# EAGLE design Tek_AVR3 revA (EAGLE 5.11)
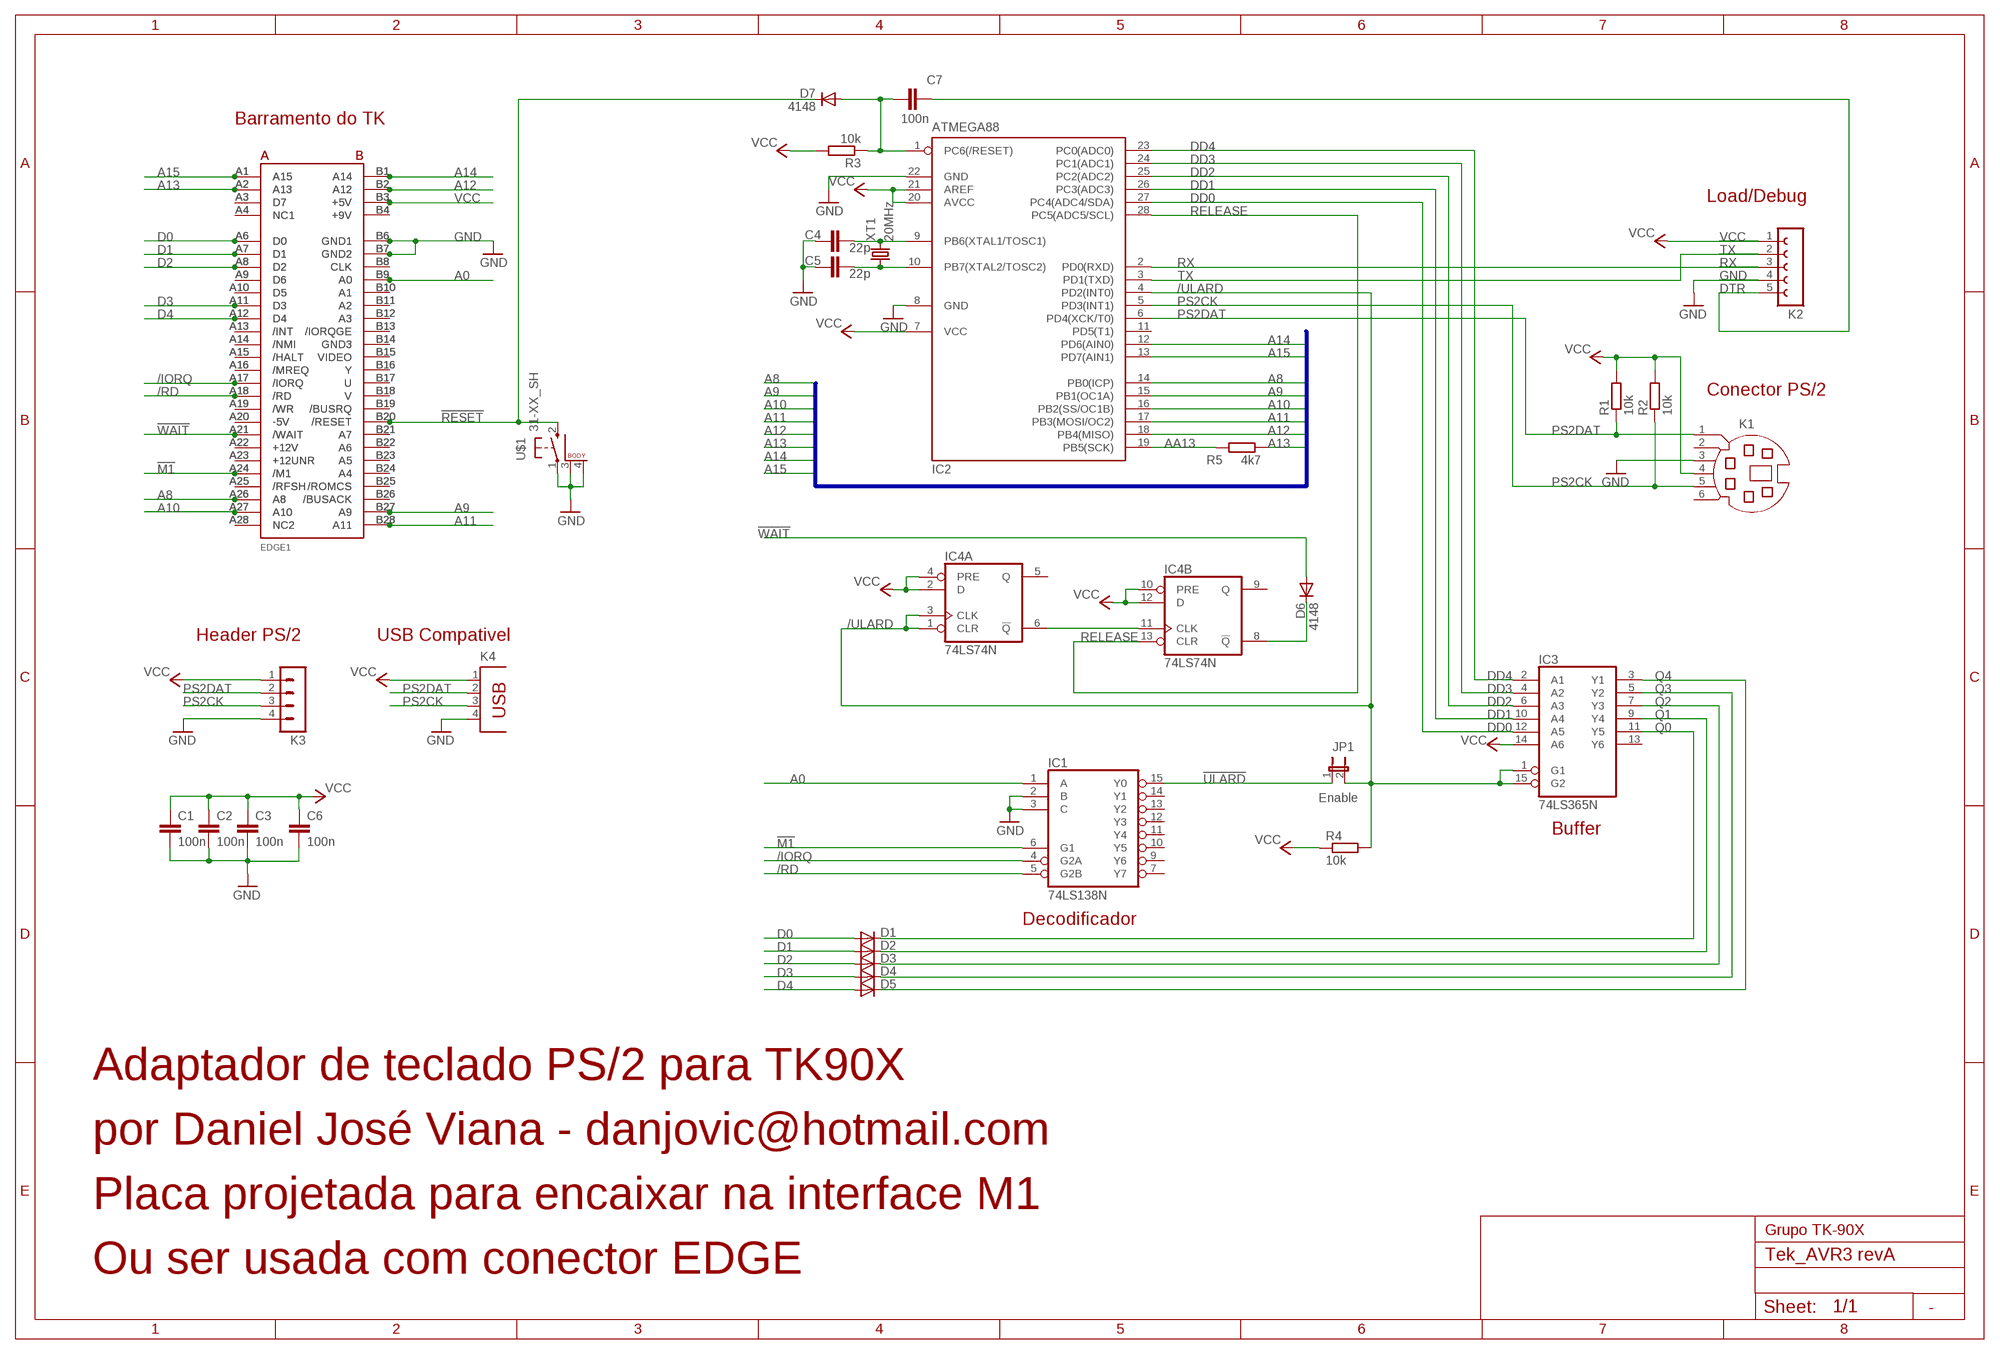
[diagram p0: schematic, sheet 1]

## Parts
C1  100n  C-EU075-032X103  [C075-032X103]
C2  100n  C-EU025-030X050  [C025-030X050]
C3  100n  C-EU050-030X075  [C050-030X075]
C4  22p  C-EU025-024X044  [C025-024X044]
C5  22p  C-EU025-025X050  [C025-025X050]
C6  100n  C-EU050-030X075  [C050-030X075]
C7  100n  C-EU050-030X075  [C050-030X075]
D1  DIODE-D-5  [D-5]
D2  DIODE-D-5  [D-5]
D3  DIODE-D-5  [D-5]
D4  DIODE-D-5  [D-5]
D5  DIODE-D-5  [D-5]
D6  4148  DIODE-D-5  [D-5]
D7  4148  DIODE-D-5  [D-5]
EDGE1  ZX-EDGEM1-NOBOARD  [ZX-M1-NOBOARD]
EDGE2  ZX-EDGE  [ZX-DIL]
IC1  74LS138N  [DIL16]
IC2  ATMEGA88  MEGA8-P  [DIL28-3]
IC3  74LS365N  [DIL16]
IC4  74LS74N  [DIL14]
JP1  Enable  JP1E  [JP1]
K1  MD06SS  [MDIN06SS]
K2  FE05-1  [FE05-1]
K3  MA04-1  [MA04-1]
K4  PN87520  [PN87520]
R1  10k  R-EU_0204/7  [0204/7]
R2  10k  R-EU_0204/7  [0204/7]
R3  10k  R-EU_0204/7  [0204/7]
R4  10k  R-EU_0204/7  [0204/7]
R5  4k7  R-EU_0204/7  [0204/7]
U$1  31-XX_SH  [B3F-31XX]
XT1  20MHz  CRYSTALHC49S  [HC49/S]

## Nets
!M1: EDGE1.A24(/M1) EDGE2.A24(/M1) IC1.6(G1)
!RESET: D7.C EDGE1.B20(/RESET) EDGE2.B20(/RESET) U$1.2(S)
!ULARD: IC1.15(Y0) JP1.1
!WAIT: D6.A EDGE1.A21(/WAIT) EDGE2.A21(/WAIT)
/IORQ: EDGE1.A17(/IORQ) EDGE2.A17(/IORQ) IC1.4(G2A)
/RD: EDGE1.A18(/RD) EDGE2.A18(/RD) IC1.5(G2B)
/ULARD: IC2.4(PD2(INT0)) IC3.1(G1) IC3.15(G2) IC4.1(A:CLR) IC4.3(A:CLK) JP1.2 R4.2
/WWAIT: D6.C IC4.8(B:!Q)
A0: EDGE1.B9(A0) EDGE2.B9(A0) IC1.1(A)
A8: EDGE1.A26(A8) EDGE2.A26(A8) IC2.14(PB0(ICP))
A9: EDGE1.B27(A9) EDGE2.B27(A9) IC2.15(PB1(OC1A))
A10: EDGE1.A27(A10) EDGE2.A27(A10) IC2.16(PB2(SS/OC1B))
A11: EDGE1.B28(A11) EDGE2.B28(A11) IC2.17(PB3(MOSI/OC2))
A12: EDGE1.B2(A12) EDGE2.B2(A12) IC2.18(PB4(MISO))
A13: EDGE1.A2(A13) EDGE2.A2(A13) R5.1
A14: EDGE1.B1(A14) EDGE2.B1(A14) IC2.12(PD6(AIN0))
A15: EDGE1.A1(A15) EDGE2.A1(A15) IC2.13(PD7(AIN1))
AA13: IC2.19(PB5(SCK)) R5.2
D0: D1.A EDGE1.A6(D0) EDGE2.A6(D0)
D1: D2.A EDGE1.A7(D1) EDGE2.A7(D1)
D2: D3.A EDGE1.A8(D2) EDGE2.A8(D2)
D3: D4.A EDGE1.A11(D3) EDGE2.A11(D3)
D4: D5.A EDGE1.A12(D4) EDGE2.A12(D4)
DD0: IC2.27(PC4(ADC4/SDA)) IC3.12(A5)
DD1: IC2.26(PC3(ADC3)) IC3.10(A4)
DD2: IC2.25(PC2(ADC2)) IC3.6(A3)
DD3: IC2.24(PC1(ADC1)) IC3.4(A2)
DD4: IC2.23(PC0(ADC0)) IC3.2(A1)
DTR: C7.2 K2.5
GND: C1.2 C2.2 C3.2 C4.1 C5.1 C6.2 EDGE1.B6(GND1) EDGE1.B7(GND2) EDGE2.B6(GND1) EDGE2.B7(GND2) IC1.2(B) IC1.3(C) IC2.8(GND) IC2.22(GND) K1.3 K2.4 K3.4 K4.4 U$1.1(P) U$1.3(P1) U$1.4(S1)
N$57: EDGE1.A3(D7) EDGE2.A3(D7)
N$59: EDGE1.A4(NC1) EDGE2.A4(NC1)
N$60: EDGE1.A9(D6) EDGE2.A9(D6)
N$61: EDGE1.A10(D5) EDGE2.A10(D5)
N$62: EDGE1.A13(/INT) EDGE2.A13(/INT)
N$63: EDGE1.A14(/NMI) EDGE2.A14(/NMI)
N$64: EDGE1.A15(/HALT) EDGE2.A15(/HALT)
N$65: EDGE1.A16(/MREQ) EDGE2.A16(/MREQ)
N$66: EDGE1.A19(/WR) EDGE2.A19(/WR)
N$67: EDGE1.A20(-5V) EDGE2.A20(-5V)
N$69: EDGE1.A22(+12V) EDGE2.A22(+12V)
N$70: EDGE1.A23(+12UNR) EDGE2.A23(+12UNR)
N$72: EDGE1.A25(/RFSH) EDGE2.A25(/RFSH)
N$73: EDGE1.A28(NC2) EDGE2.A28(NC2)
N$74: EDGE1.B14(GND3) EDGE2.B14(GND3)
N$75: EDGE1.B26(/BUSACK) EDGE2.B26(/BUSACK)
N$76: EDGE1.B25(/ROMCS) EDGE2.B25(/ROMCS)
N$77: EDGE1.B24(A4) EDGE2.B24(A4)
N$78: EDGE1.B23(A5) EDGE2.B23(A5)
N$79: EDGE1.B22(A6) EDGE2.B22(A6)
N$80: EDGE1.B21(A7) EDGE2.B21(A7)
N$82: EDGE1.B19(/BUSRQ) EDGE2.B19(/BUSRQ)
N$83: EDGE1.B18(V) EDGE2.B18(V)
N$84: EDGE1.B17(U) EDGE2.B17(U)
N$85: EDGE1.B16(Y) EDGE2.B16(Y)
N$86: EDGE1.B15(VIDEO) EDGE2.B15(VIDEO)
N$87: EDGE1.B13(/IORQGE) EDGE2.B13(/IORQGE)
N$88: EDGE1.B12(A3) EDGE2.B12(A3)
N$89: EDGE1.B11(A2) EDGE2.B11(A2)
N$90: EDGE1.B10(A1) EDGE2.B10(A1)
N$91: EDGE1.B8(CLK) EDGE2.B8(CLK)
N$92: EDGE1.B4(+9V) EDGE2.B4(+9V)
PB6: C4.2 IC2.9(PB6(XTAL1/TOSC1)) XT1.2
PB7: C5.2 IC2.10(PB7(XTAL2/TOSC2)) XT1.1
PC6/RESET: C7.1 D7.A IC2.1(PC6(/RESET)) R3.1
PS2CK: IC2.5(PD3(INT1)) K1.5 K3.3 K4.3 R2.1
PS2DAT: IC2.6(PD4(XCK/T0)) K1.1 K3.2 K4.2 R1.1
Q0: D1.C IC3.11(Y5)
Q1: D2.C IC3.9(Y4)
Q2: D3.C IC3.7(Y3)
Q3: D4.C IC3.5(Y2)
Q4: D5.C IC3.3(Y1)
RELEASE: IC2.28(PC5(ADC5/SCL)) IC4.13(B:CLR)
RX: IC2.2(PD0(RXD)) K2.3
TX: IC2.3(PD1(TXD)) K2.2
ULARD: IC4.6(A:!Q) IC4.11(B:CLK)
VCC: C1.1 C2.1 C3.1 C6.1 EDGE1.B3(+5V) EDGE2.B3(+5V) IC2.7(VCC) IC2.20(AVCC) IC2.21(AREF) IC3.14(A6) IC4.2(A:D) IC4.4(A:PRE) IC4.10(B:PRE) IC4.12(B:D) K1.4 K2.1 K3.1 K4.1 R1.2 R2.2 R3.2 R4.1
Unconnected: IC1.7(Y7) IC1.9(Y6) IC1.10(Y5) IC1.11(Y4) IC1.12(Y3) IC1.13(Y2) IC1.14(Y1) IC2.11(PD5(T1)) IC3.13(Y6) IC4.5(A:Q) IC4.9(B:Q) K1.2 K1.6

## Buses
A[8..15]

## Notes on the sheet
- Barramento do TK
- Load/Debug
- Conector PS/2
- Header PS/2 | USB Compativel
- Buffer
- Decodificador
- Adaptador de teclado PS/2 para TK90X
- por Daniel José Viana - danjovic@hotmail.com
- Placa projetada para encaixar na interface M1
- Grupo TK-90X
- Ou ser usada com conector EDGE
- -

## Power pins joined to a net without a drawn wire
GND: IC1.8(GND) IC3.8(GND) IC4.7(P:GND)
VCC: IC1.16(VCC) IC3.16(VCC) IC4.14(P:VCC)

## Library data of the parts
C1-C7 = rcl:C-EU: CAPACITOR, European symbol
D1-D7 = diode:DIODE-: DIODE
EDGE1 EDGE2 = diversos2:ZX-EDGE: ZX Spectrum Rear edge connector
IC1 = 74xx-us:74*138: 3-line to 8-line DECODER/DEMULTIPLEXER
IC2 = atmel:MEGA8-P: MICROCONTROLLER 8 Kbytes FLASH, 1 kbytes SRAM, 512 bytes EEPROM, USART, 4-channel 10 bit ADC, 2-channel 8 bit ADC Pin compatible with Atmega48, ATMega88, ATMega168 Source: avr.lbr; OC_FARNELL: unknown; OC_NEWARK: unknown
IC3 = 74xx-us:74*365: Hex BUS DRIVER, 3-state
IC4 = 74xx-us:74*74: Dual D type positive edge triggered FLIP FLOP, preset and clear
JP1 = jumper:JP1E: JUMPER
K1 = con-yamaichi:MD06SS: YAMAICHI CONNECTOR; OC_FARNELL: unknown; OC_NEWARK: unknown
K2 = con-lsta:FE05-1: FEMALE HEADER; OC_FARNELL: unknown; OC_NEWARK: unknown
K3 = con-lstb:MA04-1: PIN HEADER; OC_FARNELL: unknown; OC_NEWARK: unknown
K4 = con-berg:PN87520: BERG USB connector; OC_FARNELL: unknown; OC_NEWARK: unknown
R1-R5 = rcl:R-EU_: RESISTOR, European symbol
U$1 = switch-omron:31-XX_SH
XT1 = crystal:CRYSTAL: CRYSTAL; OC_FARNELL: 1667008; OC_NEWARK: unknown

## Board
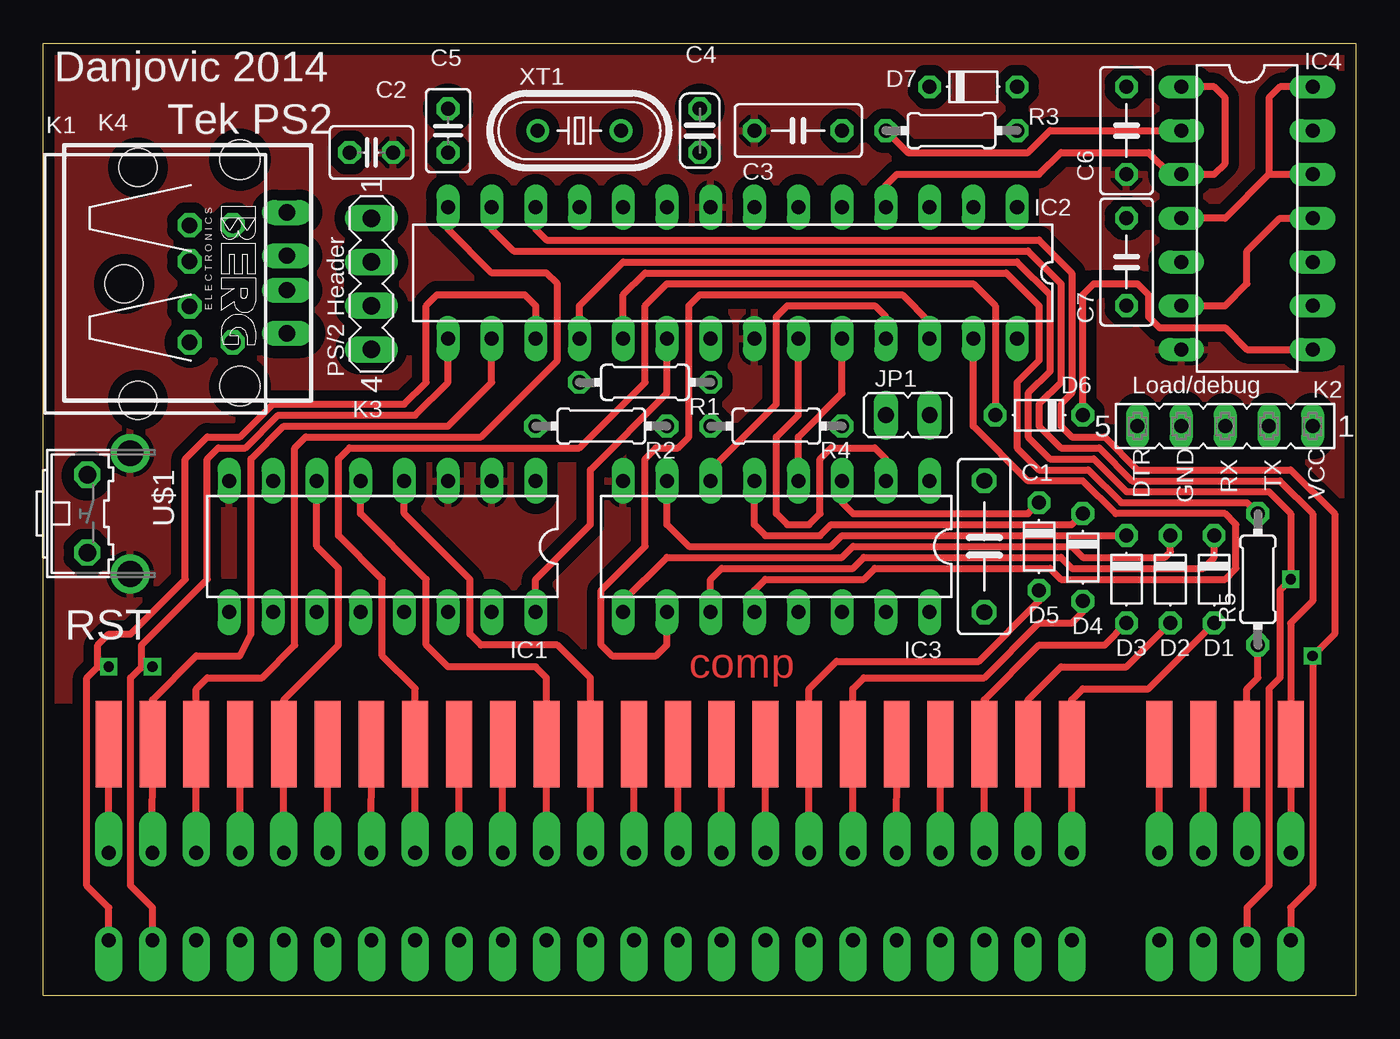
[diagram p1: board, top side]
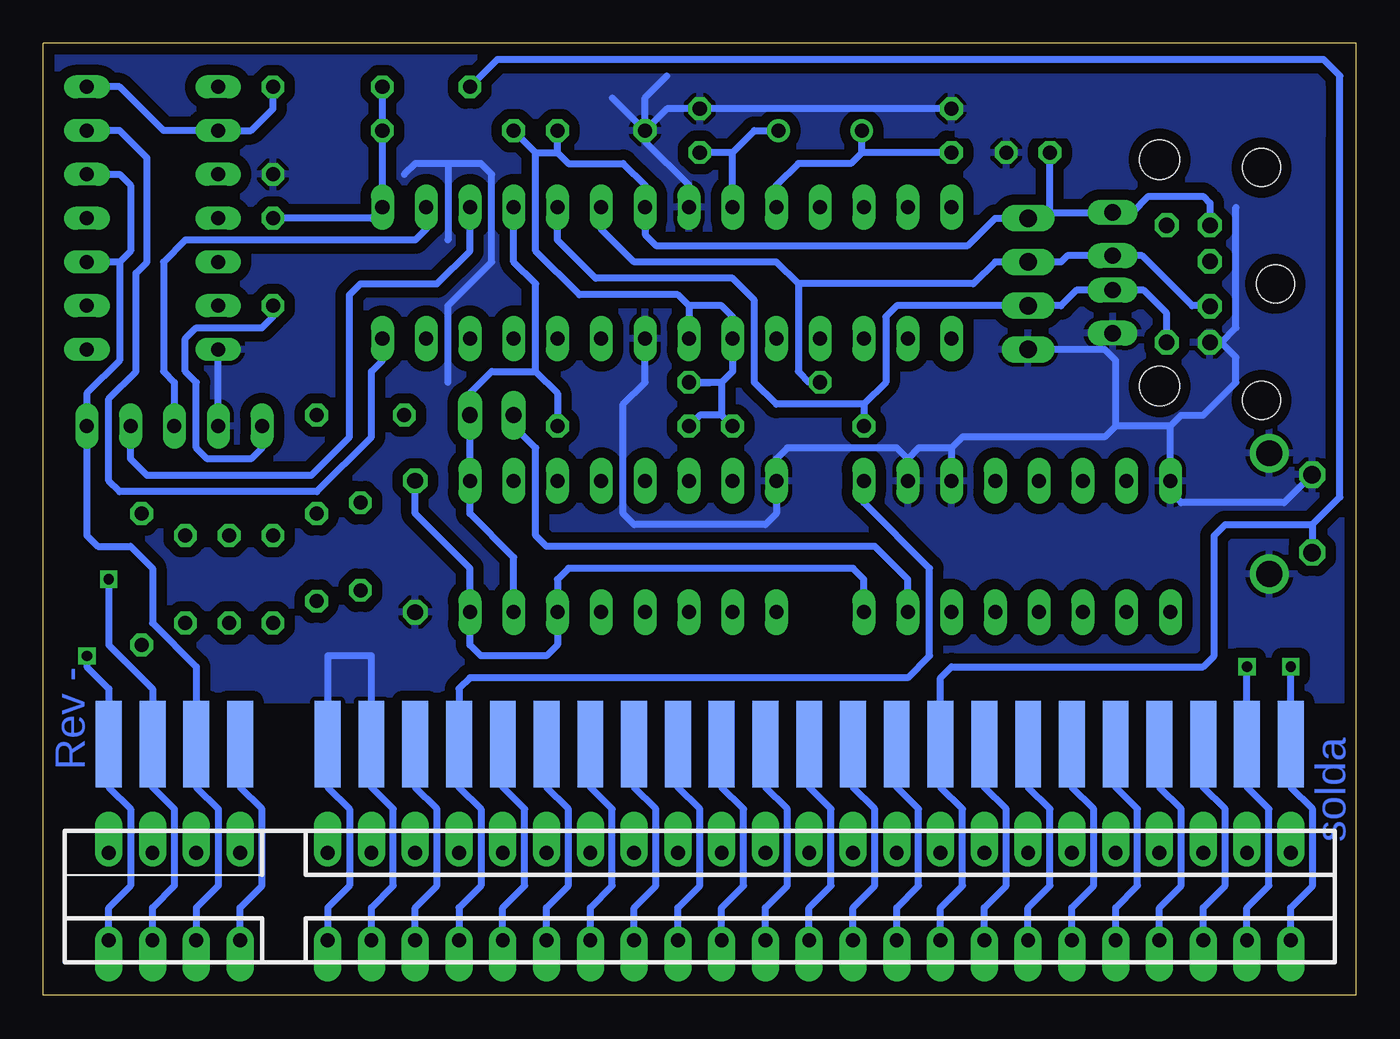
[diagram p2: board, bottom side, seen from below]

Size 76.2 x 55.25 mm. Coordinates in mm from the lower left corner, seen from the top.
Outline: 0,0 76.2,0 76.2,55.25 0,55.25 0,0
Copper layers (1*16): Top 0.035mm / dielectric 1.5mm / Bottom 0.035mm
Design rules "default *": minimum track width 10mil, minimum drill 24mil, track to track 8mil, track to pad 8mil, pad to pad 8mil, via to via 8mil, smd to smd 8mil, copper to edge 25mil, drill to drill 8mil, minimum pad ring 10mil, minimum via ring 8mil, stop-mask expansion 4mil, vias tented up to drill 0mil, thermal gap 10mil
tRestrict: area 22.9,50.8 to 24.1,52.1; area 37.5,50.8 to 38.7,52.1; area 7.9,37.2 to 9.1,38.5; area 1.9,29.5 to 3.2,30.8; area 54,21.6 to 55.2,22.9; 9 lines

### Footprints (pad centres in the part's own frame; a part is rotated, then mirrored left to right if it is on the bottom)
C075-032X103 = drill 0.914 octagon: 1 -3.81,0; 2 3.81,0
C025-030X050 = drill 0.813 octagon: 1 -1.27,0; 2 1.27,0
C050-030X075 = drill 0.813 octagon: 1 -2.54,0; 2 2.54,0
C025-024X044 = drill 0.813 octagon: 1 -1.27,0; 2 1.27,0
C025-025X050 = drill 0.813 octagon: 1 -1.27,0; 2 1.27,0
D-5 = drill 0.813 octagon: A 2.54,0; C -2.54,0
ZX-M1-NOBOARD = smd 1.5 x 5: A1 68.575,2.5; A2 66.035,2.5; A3 63.495,2.5; A4 60.955,2.5; A6 55.875,2.5; A7 53.335,2.5; A8 50.795,2.5; A9 48.255,2.5; A10 45.715,2.5; A11 43.175,2.5; A12 40.635,2.5; A13 38.095,2.5; A14 35.555,2.5; A15 33.015,2.5; A16 30.475,2.5; A17 27.935,2.5; A18 25.395,2.5; A19 22.855,2.5; A20 20.315,2.5; A21 17.775,2.5; A22 15.235,2.5; A23 12.695,2.5; A24 10.155,2.5; A25 7.615,2.5; A26 5.075,2.5; A27 2.535,2.5; A28 -0.005,2.5 | smd 1.5 x 5 bottom: B1 68.575,2.5; B2 66.035,2.5; B3 63.495,2.5; B4 60.955,2.5; B6 55.875,2.5; B7 53.335,2.5; B8 50.795,2.5; B9 48.255,2.5; B10 45.715,2.5; B11 43.175,2.5; B12 40.635,2.5; B13 38.095,2.5; B14 35.555,2.5; B15 33.015,2.5; B16 30.475,2.5; B17 27.935,2.5; B18 25.395,2.5; B19 22.855,2.5; B20 20.315,2.5; B21 17.775,2.5; B22 15.235,2.5; B23 12.695,2.5; B24 10.155,2.5; B25 7.615,2.5; B26 5.075,2.5; B27 2.535,2.5; B28 -0.005,2.5
ZX-DIL = drill 0.8 pad 1.6 offset: A1 2.54,33.02; A2 2.54,30.48; A3 2.54,27.94; A4 2.54,25.4; A6 2.54,20.32; A7 2.54,17.78; A8 2.54,15.24; A9 2.54,12.7; A10 2.54,10.16; A11 2.54,7.62; A12 2.54,5.08; A13 2.54,2.54; A14 2.54,0; A15 2.54,-2.54; A16 2.54,-5.08; A17 2.54,-7.62; A18 2.54,-10.16; A19 2.54,-12.7; A20 2.54,-15.24; A21 2.54,-17.78; A22 2.54,-20.32; A23 2.54,-22.86; A24 2.54,-25.4; A25 2.54,-27.94; A26 2.54,-30.48; A27 2.54,-33.02; A28 2.54,-35.56; B1 -2.54,33.02; B2 -2.54,30.48; B3 -2.54,27.94; B4 -2.54,25.4; B6 -2.54,20.32; B7 -2.54,17.78; B8 -2.54,15.24; B9 -2.54,12.7; B10 -2.54,10.16; B11 -2.54,7.62; B12 -2.54,5.08; B13 -2.54,2.54; B14 -2.54,0; B15 -2.54,-2.54; B16 -2.54,-5.08; B17 -2.54,-7.62; B18 -2.54,-10.16; B19 -2.54,-12.7; B20 -2.54,-15.24; B21 -2.54,-17.78; B22 -2.54,-20.32; B23 -2.54,-22.86; B24 -2.54,-25.4; B25 -2.54,-27.94; B26 -2.54,-30.48; B27 -2.54,-33.02; B28 -2.54,-35.56
DIL16 = drill 0.813 long: 1 -8.89,-3.81; 2 -6.35,-3.81; 3 -3.81,-3.81; 4 -1.27,-3.81; 5 1.27,-3.81; 6 3.81,-3.81; 7 6.35,-3.81; 8 8.89,-3.81; 9 8.89,3.81; 10 6.35,3.81; 11 3.81,3.81; 12 1.27,3.81; 13 -1.27,3.81; 14 -3.81,3.81; 15 -6.35,3.81; 16 -8.89,3.81
DIL28-3 = drill 0.813 long: 1 -16.51,-3.81; 2 -13.97,-3.81; 3 -11.43,-3.81; 4 -8.89,-3.81; 5 -6.35,-3.81; 6 -3.81,-3.81; 7 -1.27,-3.81; 8 1.27,-3.81; 9 3.81,-3.81; 10 6.35,-3.81; 11 8.89,-3.81; 12 11.43,-3.81; 13 13.97,-3.81; 14 16.51,-3.81; 15 16.51,3.81; 16 13.97,3.81; 17 11.43,3.81; 18 8.89,3.81; 19 6.35,3.81; 20 3.81,3.81; 21 1.27,3.81; 22 -1.27,3.81; 23 -3.81,3.81; 24 -6.35,3.81; 25 -8.89,3.81; 26 -11.43,3.81; 27 -13.97,3.81; 28 -16.51,3.81
DIL14 = drill 0.813 long: 1 -7.62,-3.81; 2 -5.08,-3.81; 3 -2.54,-3.81; 4 0,-3.81; 5 2.54,-3.81; 6 5.08,-3.81; 7 7.62,-3.81; 8 7.62,3.81; 9 5.08,3.81; 10 2.54,3.81; 11 0,3.81; 12 -2.54,3.81; 13 -5.08,3.81; 14 -7.62,3.81
JP1 = drill 0.914 long: 1 0,-1.27; 2 0,1.27
MDIN06SS = drill 0.9 octagon: 1 1.3,8.5; 2 -1.3,8.5; 3 3.4,8.5; 4 -3.4,8.5; 5 3.4,11; 6 -3.4,11 | hole 2.2: -6.75,5.5; 0,4.7; 6.75,5.5
FE05-1 = drill 0.813 long: 1 -5.08,0; 2 -2.54,0; 3 0,0; 4 2.54,0; 5 5.08,0
MA04-1 = drill 1.016 long: 1 -3.81,0; 2 -1.27,0; 3 1.27,0; 4 3.81,0
PN87520 = drill 0.95 long: 1 -3.5,2.71; 2 -1,2.71; 3 1,2.71; 4 3.5,2.71 | hole 2.3: -6.57,0; 6.57,0
0204/7 = drill 0.813 octagon: 1 -3.81,0; 2 3.81,0
B3F-31XX = drill 1.016 octagon: 1 -2.261,-1.245; 2 2.261,-1.245 | drill 1.499 pad 2.159 round: 3 -3.505,1.245; 4 3.505,1.245
HC49/S = drill 0.813 round: 1 -2.413,0; 2 2.413,0

### Placement (x,y rotation side)
C1  54.61,26.04 270 top
C2  19.05,48.9 0 top
C3  43.81,50.16 180 top
C4  38.1,50.16 270 top
C5  23.5,50.16 270 top
C6  62.87,50.16 270 top
C7  62.87,42.55 270 top
D1  67.94,24.13 270 top
D2  65.41,24.13 270 top
D3  62.87,24.13 270 top
D4  60.33,25.4 270 top
D5  57.78,26.04 270 top
D6  57.78,33.66 180 top
D7  53.98,52.7 0 top
EDGE1  3.81,12.06 0 top
EDGE2  39.37,5.71 90 bottom
IC1  19.68,26.04 180 top
IC2  40.01,41.91 180 top
IC3  42.55,26.04 180 top
IC4  69.85,45.09 270 top
JP1  50.16,33.66 270 top
K1  0,41.27 270 top
K2  68.58,33.02 180 top
K3  19.05,41.27 270 top
K4  11.43,41.91 270 top
R1  34.92,35.56 0 top
R2  32.38,33.02 0 top
R3  52.7,50.16 180 top
R4  42.55,33.02 0 top
R5  70.48,24.13 90 top
U$1  3.81,27.94 270 top
XT1  31.11,50.16 0 top

### Tracks (layer width: path | path; a pad name or v marks a point on that pad's centre or on a via)
!M1
  Top 0.406: EDGE2.A24 EDGE1.A24 13.97,17.14 17.14,20.32 17.14,24.77 15.88,26.04 IC1.6
!RESET
  Bottom 0.406: EDGE2.B20 24.13,5.08 22.86,6.35 22.86,10.79 24.12,12.06 EDGE1.B20 24.13,18.42 23.5,19.05 8.89,19.05 8.26,19.69 8.26,26.67 7.62,27.3 2.56,27.3 | D7.C 49.85,54.29 1.91,54.29 0.95,53.34 0.95,28.89 0.98,28.89 2.56,27.3 | 2.56,27.3 U$1.2
!ULARD
  Bottom 0.406: IC1.15 26.04,24.13 27.94,26.04 46.99,26.04 47.62,26.67 47.62,31.75 48.9,33.02 JP1.1
!WAIT
  Top 0.406: EDGE2.A21 EDGE1.A21 21.59,17.79 19.68,19.69 19.68,24.13 17.14,26.67 17.14,31.12 17.78,31.75 31.11,31.75 34.92,35.56 34.92,40.01 36.2,41.27 53.98,41.27 55.24,40.01 D6.A
/IORQ
  Top 0.406: EDGE2.A17 EDGE1.A17 31.75,18.42 29.84,20.32 25.4,20.32 24.77,20.96 24.77,24.13 20.95,27.94 IC1.4
/RD
  Top 0.406: EDGE2.A18 EDGE1.A18 29.21,18.42 28.57,19.05 23.5,19.05 22.23,20.32 22.23,24.13 18.41,27.94 IC1.5
/ULARD
  Top 0.406: IC2.4 48.9,46.99 49.53,47.62 57.78,47.62 59.05,48.9 64.14,48.9 65.41,47.62 IC4.3 67.94,47.62 68.58,48.26 68.58,52.07 67.94,52.7 IC4.1
  Bottom 0.406: IC2.4 48.9,42.55 47.62,41.27 47.62,36.2 | R4.2 46.35,34.93 47.62,36.2 | 47.62,36.2 50.16,36.2 51.44,34.93 JP1.2 IC3.1 51.44,27.94 48.9,25.4 IC3.15
/WWAIT
  Top 0.406: IC4.8 69.85,37.47 68.58,38.73 64.77,38.73 64.14,39.37 64.14,40.64 63.5,41.27 60.96,41.27 60.33,40.64 D6.C
A0
  Bottom 0.406: EDGE2.B9 52.07,5.08 50.8,6.35 50.8,10.79 52.06,12.06 EDGE1.B9 52.06,17.79 51.44,18.42 26.04,18.42 24.77,19.69 24.77,24.77 28.57,28.58 IC1.1
A8
  Top 0.406: EDGE2.A26 EDGE1.A26 8.89,17.78 9.53,18.42 12.7,18.42 14.61,20.32 14.61,31.75 15.24,32.38 25.4,32.38 29.84,36.83 29.84,41.27 29.21,41.91 26.04,41.91 23.5,44.45 IC2.14
A9  (via drill 0.6)
  Top 0.406: IC2.15 23.5,35.56 21.59,33.66 13.65,33.66 11.75,31.75 10.16,31.75 9.53,31.12 9.53,24.13 5.71,20.32 5.71,19.05 | 5.71,19.05 v6.35,19.05 | 5.71,19.05 5.08,18.42 5.08,6.35 6.35,5.08 EDGE2.B27
  Bottom 0.406: EDGE2.B27 6.35,5.08 5.08,6.35 5.08,10.79 6.34,12.06 EDGE1.B27 v6.35,19.05
A10
  Top 0.406: EDGE2.A27 EDGE1.A27 6.35,17.14 8.89,19.69 11.43,19.69 12.06,20.96 12.06,31.12 13.97,33.02 23.5,33.02 26.04,35.56 IC2.16
A11  (via drill 0.6)
  Top 0.406: IC2.17 28.57,40.01 27.94,40.64 22.86,40.64 22.23,40.01 22.23,35.56 20.95,34.29 13.34,34.29 11.43,32.38 9.53,32.38 8.26,31.12 8.26,24.13 5.08,20.96 3.81,20.96 3.17,20.32 3.17,19.05 | 3.17,19.05 v3.81,19.05 | 3.17,19.05 2.54,18.42 2.54,6.35 3.81,5.08 EDGE2.B28
  Bottom 0.406: EDGE2.B28 3.81,5.08 2.54,6.35 2.54,10.79 3.81,12.06 EDGE1.B28 v3.81,19.05
A12  (via drill 0.6)
  Top 0.406: IC2.18 31.11,40.01 33.66,42.55 56.52,42.55 58.42,40.64 58.42,36.2 57.15,34.93 57.15,32.38 58.42,31.12 60.96,31.12 62.87,29.21 71.12,29.21 72.39,27.94 v72.39,24.13 71.75,23.5 71.75,18.42 71.12,17.78 71.12,6.35 69.85,5.08 EDGE2.B2
  Bottom 0.406: EDGE2.B2 69.85,5.08 68.58,6.35 68.58,10.79 69.84,12.06 EDGE1.B2 69.85,17.78 72.39,20.32 v72.39,24.13
A13
  Top 0.406: EDGE2.A2 EDGE1.A2 69.85,17.78 70.48,18.42 R5.1
A14  (via drill 0.6)
  Top 0.406: IC2.12 28.57,44.45 29.21,43.81 57.78,43.81 59.69,41.91 59.69,34.93 59.05,34.29 59.05,33.02 59.69,32.38 61.59,32.38 63.5,30.48 72.39,30.48 74.93,27.94 74.93,20.96 v73.66,19.69 73.66,6.35 72.39,5.08 EDGE2.B1
  Bottom 0.406: EDGE2.B1 72.39,5.08 71.12,6.35 71.12,10.79 72.39,12.06 EDGE1.B1 72.39,17.78 73.66,19.05 v73.66,19.69
A15
  Top 0.406: EDGE1.A1 72.39,14.6 | EDGE1.A1 EDGE2.A1 | IC2.13 26.04,44.45 27.3,43.18 57.15,43.18 59.05,41.27 59.05,35.56 57.78,34.29 57.78,33.02 59.05,31.75 61.28,31.75 63.18,29.85 71.75,29.85 73.66,27.94 73.66,22.86 72.39,21.59 EDGE1.A1
AA13
  Top 0.406: IC2.19 33.66,40.64 34.92,41.91 55.88,41.91 57.78,40.01 57.78,36.83 56.52,35.56 56.52,31.75 57.78,30.48 60.64,30.48 62.55,28.58 69.85,28.58 R5.2
D0
  Top 0.406: EDGE1.A6 | EDGE2.A6 EDGE1.A6 | EDGE1.A6 59.69,17.14 60.33,17.78 64.14,17.78 D1.A
D1
  Top 0.406: EDGE2.A7 EDGE1.A7 57.15,17.14 59.05,19.05 62.87,19.05 D2.A
D2
  Top 0.406: EDGE1.A8 | EDGE2.A8 EDGE1.A8 | EDGE1.A8 54.6,17.14 57.78,20.32 61.59,20.32 D3.A
D3
  Top 0.406: EDGE2.A11 EDGE1.A11 46.98,17.77 47.62,18.42 54.61,18.42 57.78,21.59 59.69,21.59 60.33,22.23 D4.A
D4
  Top 0.406: EDGE1.A12 | EDGE1.A12 EDGE2.A12 | EDGE1.A12 44.45,17.77 46.04,19.37 54.29,19.37 57.78,22.86 D5.A
DD0
  Top 0.406: IC3.12 41.27,23.5 41.91,24.13 47.62,24.13 48.26,24.77 58.42,24.77 59.05,24.13 68.58,24.13 69.22,24.77 69.22,26.04 69.22,27.3 68.58,27.94 62.23,27.94 60.33,29.85 57.15,29.85 53.98,33.02 IC2.27
DD1
  Top 0.406: IC2.26 51.44,39.05 49.85,40.64 38.1,40.64 37.47,40.01 37.47,32.38 36.83,31.75 35.56,31.75 34.92,31.12 34.92,26.04 32.38,23.5 32.38,20.32 33.02,19.69 35.56,19.69 36.2,20.32 IC3.10
DD2
  Top 0.406: IC3.6 38.73,30.48 42.55,34.29 42.55,39.37 43.18,40.01 48.26,40.01 48.9,39.37 IC2.25
DD3
  Top 0.406: IC3.4 43.81,32.38 46.35,34.93 IC2.24
DD4
  Top 0.406: IC3.2 48.9,31.12 48.26,31.75 45.72,31.75 45.09,31.12 45.09,27.94 44.45,27.3 43.18,27.3 42.55,27.94 42.55,32.38 43.81,33.66 IC2.23
DTR
  Bottom 0.406: C7.2 62.87,39.37 63.5,38.73 67.31,38.73 67.94,38.1 67.94,36.2 67.31,35.56 67.31,31.75 66.67,31.12 64.14,31.12 63.5,31.75 K2.5
GND
  Bottom 0.406: EDGE1.B7 | EDGE1.B7 57.15,12.06 55.88,10.79 55.88,6.35 57.15,5.08 EDGE2.B7 | EDGE2.B6 59.69,5.08 58.42,6.35 58.42,10.79 59.69,12.06 59.69,13.97 EDGE1.B6 | C5.1 C4.1 40.01,51.44 C3.2 | C3.2 41.27,49.53 38.73,46.99 IC2.8 | 23.5,31.75 IC1.3 | 23.5,31.75 25.4,31.75 26.04,31.12 | 23.5,31.75 22.86,32.38 14.61,32.38 13.97,33.02 | 26.04,31.12 IC1.2 | 26.04,31.12 26.67,31.75 33.02,31.75 33.66,31.12 IC3.8 33.66,27.94 34.29,27.3 41.91,27.3 42.55,27.94 42.55,34.29 41.27,35.56 IC2.22 | EDGE1.B6 | C3.2 43.18,52.07 | 40.01,53.34 41.27,52.07 C3.2 | 52.7,35.56 52.7,40.01 50.16,42.55 50.16,47.62 50.8,48.26 52.7,48.26 | U$1.1 4.19,28.58 10.16,28.58 10.79,29.21 IC1.8 10.79,33.02 | 52.7,48.26 54.61,48.26 55.24,47.62 | K3.4 14.61,37.47 13.97,36.83 13.97,33.02 | 10.79,33.02 13.97,33.02 | 10.79,33.02 10.16,33.66 8.89,33.66 6.99,35.56 6.99,37.02 7.84,37.88 | 6.99,45.72 6.99,38.73 7.84,37.88 | 7.84,37.88 K1.3 | K2.4 IC4.7 | 52.7,48.26 52.7,43.81 | EDGE1.B7 57.15,19.69 59.69,19.69 EDGE1.B6
  pour Bottom (isolate 0.61): -0.64,55.25 -0.64,17.14 76.83,17.14 76.83,55.25
  pour Top (isolate 0.61): 0,55.88 0,17.14 76.83,17.14 76.83,55.88
N$50
  pour Bottom: 23.18,49.85 1.91,49.85 1.91,52.7 2.54,53.34 23.18,53.34
N$57
  Top 0.406: EDGE1.A3 EDGE2.A3
N$59
  Top 0.406: EDGE1.A4 EDGE2.A4
N$60
  Top 0.406: EDGE2.A9 EDGE1.A9
N$61
  Top 0.406: EDGE1.A10 EDGE2.A10
N$62
  Top 0.406: EDGE1.A13 EDGE2.A13
N$63
  Top 0.406: EDGE1.A14 EDGE2.A14
N$64
  Top 0.406: EDGE1.A15 EDGE2.A15
N$65
  Top 0.406: EDGE1.A16 EDGE2.A16
N$66
  Top 0.406: EDGE1.A19 EDGE2.A19
N$67
  Top 0.406: EDGE1.A20 EDGE2.A20
N$69
  Top 0.406: EDGE1.A22 EDGE2.A22
N$70
  Top 0.406: EDGE1.A23 EDGE2.A23
N$72
  Top 0.406: EDGE1.A25 EDGE2.A25
N$73
  Top 0.406: EDGE1.A28 EDGE2.A28
N$74
  Bottom 0.406: EDGE1.B14 39.37,12.06 38.1,10.79 38.1,6.35 39.37,5.08 EDGE2.B14
N$75
  Bottom 0.406: EDGE1.B26 8.88,12.06 7.62,10.79 7.62,6.35 8.89,5.08 EDGE2.B26
N$76
  Bottom 0.406: EDGE1.B25 11.43,12.06 10.16,10.79 10.16,6.35 11.43,5.08 EDGE2.B25
N$77
  Bottom 0.406: EDGE1.B24 13.96,12.06 12.7,10.79 12.7,6.35 13.97,5.08 EDGE2.B24
N$78
  Bottom 0.406: EDGE1.B23 16.5,12.06 15.24,10.79 15.24,6.35 16.51,5.08 EDGE2.B23
N$79
  Bottom 0.406: EDGE2.B22 19.05,5.08 17.78,6.35 17.78,10.79 19.05,12.06 EDGE1.B22
N$80
  Bottom 0.406: EDGE1.B21 21.59,12.06 20.32,10.79 20.32,6.35 21.59,5.08 EDGE2.B21
N$82
  Bottom 0.406: EDGE1.B19 26.66,12.06 25.4,10.79 25.4,6.35 26.67,5.08 EDGE2.B19
N$83
  Bottom 0.406: EDGE1.B18 29.2,12.06 27.94,10.79 27.94,6.35 29.21,5.08 EDGE2.B18
N$84
  Bottom 0.406: EDGE1.B17 31.75,12.06 30.48,10.79 30.48,6.35 31.75,5.08 EDGE2.B17
N$85
  Bottom 0.406: EDGE1.B16 34.28,12.06 33.02,10.79 33.02,6.35 34.29,5.08 EDGE2.B16
N$86
  Bottom 0.406: EDGE1.B15 36.83,12.06 35.56,10.79 35.56,6.35 36.83,5.08 EDGE2.B15
N$87
  Bottom 0.406: EDGE1.B13 41.91,12.06 40.64,10.79 40.64,6.35 41.91,5.08 EDGE2.B13
N$88
  Bottom 0.406: EDGE1.B12 44.45,12.06 43.18,10.79 43.18,6.35 44.45,5.08 EDGE2.B12
N$89
  Bottom 0.406: EDGE1.B11 46.98,12.06 45.72,10.79 45.72,6.35 46.99,5.08 EDGE2.B11
N$90
  Bottom 0.406: EDGE1.B10 49.52,12.06 48.26,10.79 48.26,6.35 49.53,5.08 EDGE2.B10
N$91
  Bottom 0.406: EDGE1.B8 54.6,12.06 53.34,10.79 53.34,6.35 54.61,5.08 EDGE2.B8
N$92
  Bottom 0.406: EDGE1.B4 64.77,12.06 63.5,10.79 63.5,6.35 64.77,5.08 EDGE2.B4
PB6
  Bottom 0.406: XT1.2 34.92,50.16 36.2,48.9 | 36.2,48.9 C4.2 | IC2.9 36.2,48.9
PB7
  Bottom 0.406: C5.2 28.7,48.9 | 28.7,48.9 XT1.1 | IC2.10 33.66,46.99 32.38,48.26 29.34,48.26 28.7,48.9
PC6/RESET
  Bottom 0.406: D7.A R3.1 IC2.1 57.15,45.09 C7.1
PS2CK
  Bottom 0.406: IC2.5 46.35,43.81 44.13,41.59 36.2,41.59 34.92,40.32 34.92,35.56 33.66,34.29 28.57,34.29 | 28.57,34.29 R2.1 | 28.57,34.29 27.3,35.56 27.3,39.37 26.67,40.01 K3.3 17.14,40.01 16.24,40.91 K4.3 12.34,40.91 11,39.58 K1.5
PS2DAT
  Bottom 0.406: IC2.6 43.81,44.45 41.91,42.55 33.66,42.55 32.38,41.27 | 32.38,41.27 32.38,36.2 31.75,35.56 R1.1 | 32.38,41.27 22.23,41.27 20.95,42.55 K3.2 17.14,42.55 16.78,42.91 K4.2 12.43,42.91 9.53,40.01 8.53,40.01 K1.1
Q0
  Top 0.406: IC3.11 38.73,24.13 39.37,24.77 46.99,24.77 47.62,25.4 59.05,25.4 59.69,24.77 67.31,24.77 67.94,25.4 67.94,26.04 D1.C
Q1
  Top 0.406: IC3.9 33.66,22.86 36.2,25.4 46.35,25.4 46.99,26.04 59.69,26.04 60.33,25.4 65.09,25.4 65.41,25.72 D2.C
Q2
  Top 0.406: IC3.7 36.2,27.3 37.47,26.04 45.72,26.04 46.35,26.67 D3.C
Q3
  Top 0.406: D4.C 59.69,27.3 45.72,27.3 45.09,26.67 41.91,26.67 41.27,27.3 IC3.5
Q4
  Top 0.406: D5.C 57.15,27.94 46.99,27.94 46.35,28.58 IC3.3
RELEASE
  Bottom 0.406: IC2.28 56.52,36.83 57.15,36.2 57.15,32.38 60.33,29.21 71.75,29.21 72.39,29.85 72.39,34.61 70.8,36.2 70.8,41.91 70.17,42.55 70.17,48.58 71.75,50.16 IC4.13
RX
  Bottom 0.406: IC2.2 53.98,44.45 54.61,43.81 67.94,43.81 69.22,42.55 69.22,36.2 68.58,35.56 K2.3
TX
  Bottom 0.406: IC2.3 51.44,43.18 53.34,41.27 57.78,41.27 58.42,40.64 58.42,32.38 60.64,30.16 70.17,30.16 71.12,31.12 K2.2
ULARD
  Top 0.406: IC4.6 68.58,40.01 69.85,41.27 69.85,43.18 71.75,45.09 IC4.11
VCC
  Top 0.406: IC2.20 36.2,34.93 31.75,30.48 31.75,27.3 28.57,24.13 IC1.16 | IC4.14 71.75,52.7 71.12,52.07 71.12,47.62 | R3.2 50.16,48.9 57.15,48.9 58.42,50.16 IC4.2 | 71.12,47.62 68.58,45.09 IC4.4 | 71.12,47.62 IC4.12
  Bottom 0.406: EDGE2.B3 67.31,5.08 66.04,6.35 66.04,10.79 67.31,12.06 EDGE1.B3 67.31,18.41 67.31,19.05 69.85,21.59 69.85,24.77 71.12,26.04 73.03,26.04 73.66,26.67 K2.1 73.66,34.93 71.75,36.83 71.75,42.55 | 47.62,48.9 46.35,48.9 | 47.62,48.9 R3.2 | 46.35,48.9 C3.1 | 46.35,48.9 45.72,48.26 42.55,48.26 41.27,46.99 IC2.7 41.27,44.13 40.64,43.5 22.54,43.5 20.95,45.09 K3.1 18.1,45.09 17.77,45.41 | 36.83,35.56 R1.2 37.47,35.56 | 36.83,35.56 36.83,33.66 | 36.83,33.66 R2.2 | 36.83,35.56 36.2,36.2 IC2.20 36.2,39.37 36.83,40.01 38.73,40.01 | 38.73,40.01 IC2.21 | 38.73,40.01 39.37,40.64 45.09,40.64 47.62,43.18 47.62,48.9 | 36.83,33.66 38.1,33.66 R4.1 | 71.75,42.55 71.12,43.18 71.12,46.99 71.75,47.62 IC4.12 | C6.1 62.87,51.44 64.14,50.16 IC4.2 69.22,50.16 71.75,52.7 IC4.14 | 71.75,42.55 IC4.10 | 17.77,45.41 K4.1 13.01,45.41 12.06,46.36 8.89,46.36 8.5,45.97 K1.4 | 17.77,45.41 17.77,48.25 C2.1 | IC1.16 28.57,24.13 29.21,24.77 45.72,24.77 46.35,24.13 IC3.14 46.35,20.32 46.99,19.69 50.8,19.69 51.44,20.32 IC3.16 51.44,24.77 54.61,27.94 C1.1

### Text on the board
Top: comp
Bottom: Rev - | solda
tPlace: Danjovic 2014 | Tek PS2 | PS/2 Header | Load/debug | DTR | GND | VCC | RX | TX | RST
bRestrict: Danjovic 2014
tDocu: Adaptador de teclado PS/2 para TK90X | por Daniel José Viana - danjovic@hotmail.com | Placa projetada para encaixar na interface M1 | ou em conector EDGE